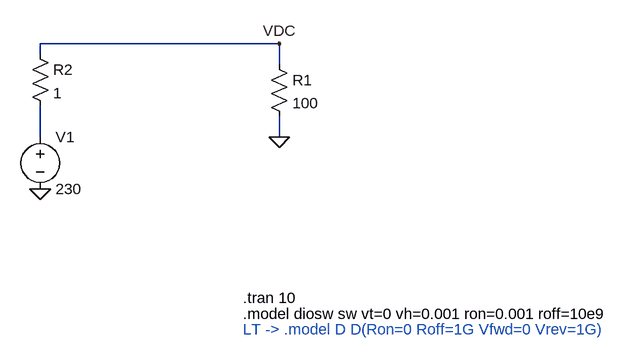
[diagram p0: schematic Generator-Test.asc]
Generator-Test.asc, the LTspice schematic file:
Version 4
SHEET 1 1272 680
WIRE 624 -64 256 -64
WIRE 256 -48 256 -64
WIRE 624 -32 624 -64
WIRE 256 80 256 32
WIRE 624 80 624 48
FLAG 624 80 0
FLAG 624 -64 VDC
FLAG 256 160 0
DATAFLAG 384 -64 ""
SYMBOL voltage 256 64 R0
WINDOW 123 0 0 Left 0
WINDOW 39 0 0 Left 0
SYMATTR InstName V1
SYMATTR Value 230
SYMBOL res 608 -48 R0
SYMATTR InstName R1
SYMATTR Value 100
SYMBOL res 240 -64 R0
SYMATTR InstName R2
SYMATTR Value 1
TEXT 568 328 Left 2 !.tran 10
TEXT 568 352 Left 2 !.model diosw sw vt=0 vh=0.001 ron=0.001 roff=10e9
TEXT 568 376 Left 2 ;LT -> .model D D(Ron=0 Roff=1G Vfwd=0 Vrev=1G)

The netlist it stands for:
* Generator-Test.asc
V1 N001 0 230
R1 VDC 0 100
R2 VDC N001 1
.tran 10
.model diosw sw vt=0 vh=0.001 ron=0.001 roff=10e9
* LT -> .model D D(Ron=0 Roff=1G Vfwd=0 Vrev=1G)
.backanno
.end